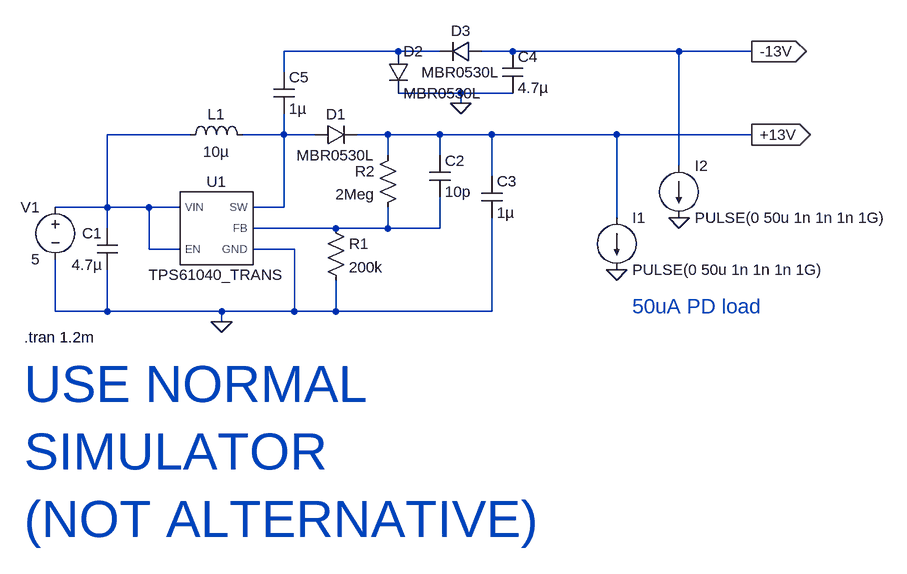
[diagram p0: schematic AAA_reverse_bias_sim.asc]
AAA_reverse_bias_sim.asc, the LTspice schematic file:
Version 4
SHEET 1 952 680
WIRE -160 -96 -336 -96
WIRE -96 -96 -160 -96
WIRE 16 -96 -32 -96
WIRE 272 -96 16 -96
WIRE 384 -96 272 -96
WIRE -336 -64 -336 -96
WIRE -64 -32 -160 -32
WIRE 16 -32 -64 -32
WIRE -64 -16 -64 -32
WIRE -480 32 -608 32
WIRE -336 32 -336 0
WIRE -336 32 -400 32
WIRE -288 32 -336 32
WIRE -176 32 -224 32
WIRE -96 32 -176 32
WIRE -16 32 -96 32
WIRE 176 32 -16 32
WIRE 384 32 176 32
WIRE -176 64 -176 32
WIRE -96 64 -96 32
WIRE 272 80 272 -96
WIRE -16 96 -16 32
WIRE -608 144 -608 32
WIRE -608 144 -688 144
WIRE -544 144 -608 144
WIRE -496 144 -544 144
WIRE -336 144 -336 32
WIRE -336 144 -384 144
WIRE 176 160 176 32
WIRE -608 176 -608 144
WIRE -256 176 -384 176
WIRE -176 176 -176 144
WIRE -176 176 -256 176
WIRE -96 176 -96 128
WIRE -96 176 -176 176
WIRE -544 208 -544 144
WIRE -496 208 -544 208
WIRE -320 208 -384 208
WIRE -688 304 -688 224
WIRE -608 304 -608 240
WIRE -608 304 -688 304
WIRE -432 304 -608 304
WIRE -320 304 -320 208
WIRE -320 304 -432 304
WIRE -256 304 -256 256
WIRE -256 304 -320 304
WIRE -16 304 -16 160
WIRE -16 304 -256 304
WIRE -432 320 -432 304
FLAG -432 320 0
FLAG -64 -16 0
FLAG 384 -96 -13V
IOPIN 384 -96 Out
FLAG 384 32 +13V
IOPIN 384 32 Out
FLAG 272 160 0
FLAG 176 240 0
SYMBOL TPS61040_TRANS -448 176 R0
SYMATTR InstName U1
SYMBOL cap -592 176 M0
SYMATTR InstName C1
SYMATTR Value 4.7µ
SYMBOL voltage -688 128 M0
WINDOW 123 0 0 Left 0
WINDOW 39 0 0 Left 0
SYMATTR InstName V1
SYMATTR Value 5
SYMBOL ind -496 48 R270
WINDOW 0 32 56 VTop 2
WINDOW 3 5 56 VBottom 2
SYMATTR InstName L1
SYMATTR Value 10µ
SYMBOL res -272 160 R0
SYMATTR InstName R1
SYMATTR Value 200k
SYMBOL res -160 48 M0
SYMATTR InstName R2
SYMATTR Value 2Meg
SYMBOL cap -112 64 R0
SYMATTR InstName C2
SYMATTR Value 10p
SYMBOL cap -32 96 R0
SYMATTR InstName C3
SYMATTR Value 1µ
SYMBOL diode -288 48 R270
WINDOW 0 32 32 VTop 2
WINDOW 3 0 32 VBottom 2
SYMATTR InstName D1
SYMATTR Value MBR0530L
SYMBOL diode -176 -96 R0
SYMATTR InstName D2
SYMATTR Value MBR0530L
SYMBOL diode -32 -112 R90
WINDOW 0 0 32 VBottom 2
WINDOW 3 32 32 VTop 2
SYMATTR InstName D3
SYMATTR Value MBR0530L
SYMBOL cap 0 -96 R0
SYMATTR InstName C4
SYMATTR Value 4.7µ
SYMBOL cap -352 -64 R0
SYMATTR InstName C5
SYMATTR Value 1µ
SYMBOL current 272 80 R0
WINDOW 123 0 0 Left 0
WINDOW 39 0 0 Left 0
SYMATTR InstName I2
SYMATTR Value PULSE(0 50u 1n 1n 1n 1G)
SYMBOL current 176 160 R0
WINDOW 123 0 0 Left 0
WINDOW 39 0 0 Left 0
SYMATTR InstName I1
SYMATTR Value PULSE(0 50u 1n 1n 1n 1G)
TEXT -736 344 Left 2 !.tran 1.2m
TEXT -736 416 Left 6 ;USE NORMAL\nSIMULATOR\n(NOT ALTERNATIVE)
TEXT 200 296 Left 3 ;50uA PD load

The netlist it stands for:
* AAA_reverse_bias_sim.asc
XU1 N002 N004 N003 N002 0 TPS61040_TRANS  ; pins EN FB SW VIN GND
C1 N002 0 4.7µ
V1 N002 0 5
L1 N002 N003 10µ
R1 N004 0 200k
R2 +13V N004 2Meg
C2 +13V N004 10p
C3 +13V 0 1µ
D1 N003 +13V MBR0530L
D2 N001 0 MBR0530L
D3 -13V N001 MBR0530L
C4 -13V 0 4.7µ
C5 N001 N003 1µ
I2 -13V 0 PULSE(0 50u 1n 1n 1n 1G)
I1 +13V 0 PULSE(0 50u 1n 1n 1n 1G)
.model D D
.lib standard.dio
.tran 1.2m
* USE NORMAL
* SIMULATOR
* (NOT ALTERNATIVE)
* 50uA PD load
.lib TPS61040_TRANS.lib
.backanno
.end